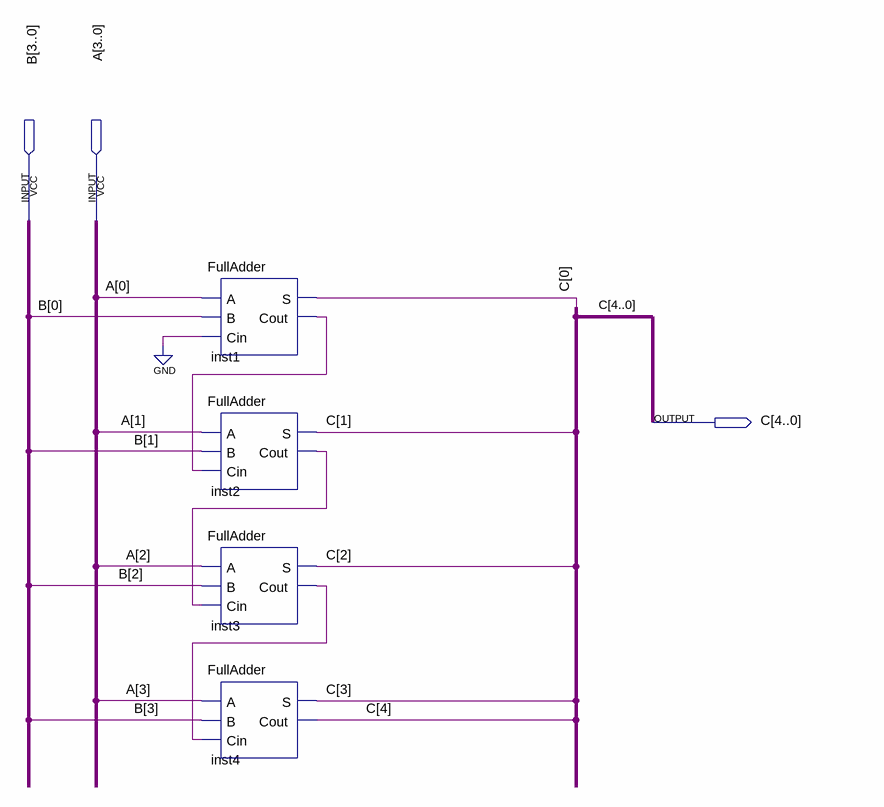
[diagram p0: schematic sheet]
// Quartus schematic SomAB.bdf as structural Verilog: 4 symbols, 3 pins
module SomAB (
  input  [3:0] B,
  input  [3:0] A,
  output [4:0] C
);

  wire inst1_cout, inst2_cout, inst3_cout;

  FullAdder inst1 (.A(A[0]), .B(B[0]), .Cin(1'b0), .S(C[0]), .Cout(inst1_cout));
  FullAdder inst2 (.A(A[1]), .B(B[1]), .Cin(inst1_cout), .S(C[1]), .Cout(inst2_cout));
  FullAdder inst3 (.A(A[2]), .B(B[2]), .Cin(inst2_cout), .S(C[2]), .Cout(inst3_cout));
  FullAdder inst4 (.A(A[3]), .B(B[3]), .Cin(inst3_cout), .S(C[3]), .Cout(C[4]));
endmodule
